# EasyEDA Pro project 主板.eprj, schematic Schematic1
Board Name: Board1; Create Date: 2024-09-01; Page Name: P1; Project Name: 主板; Schematic Name: Schematic1; Update Date: 2024-10-02; Company: 嘉立创EDA; Drawed: wiselook; Page Size: A4; Version: V1.0
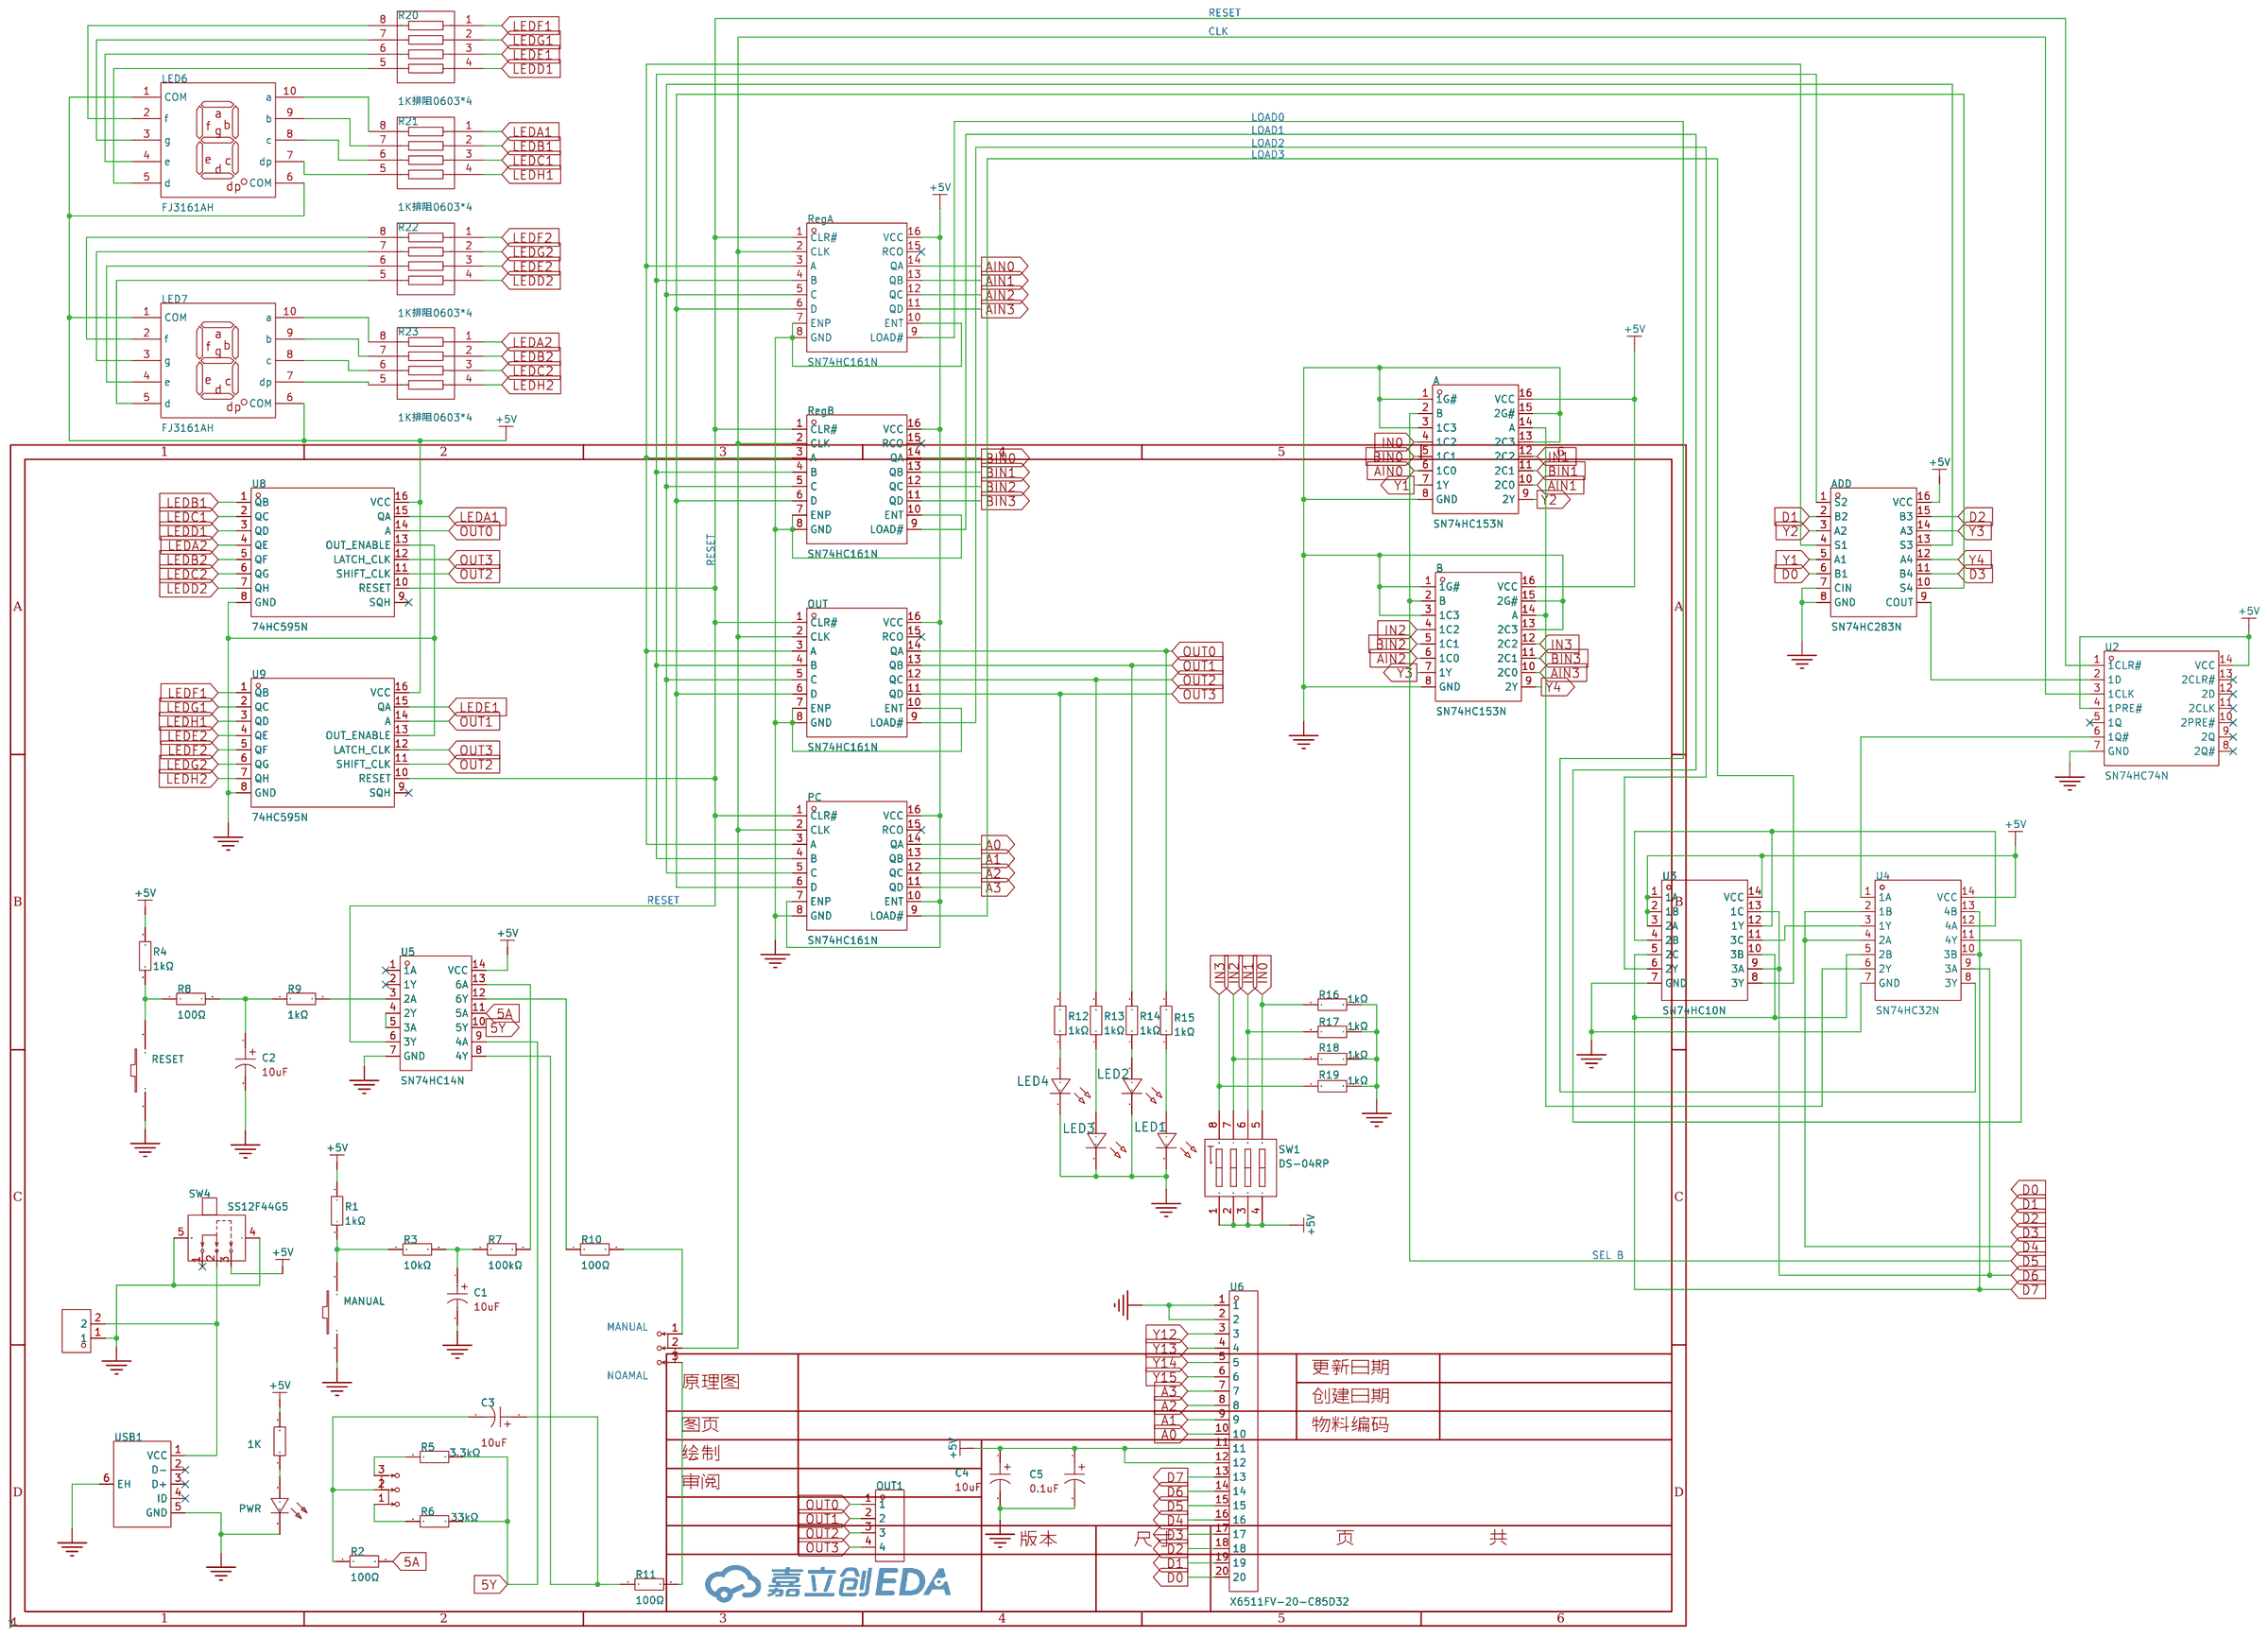
[diagram p0: schematic sheet]

## Parts
A  SN74HC153N  [DIP-16_L20.3-W10.1-P2.54-LS7.62-BL]
ADD  SN74HC283N  [DIP-16_L20.3-W10.2-P2.54-LS7.6-BL]
B  SN74HC153N  [DIP-16_L20.3-W10.1-P2.54-LS7.62-BL]
C1  电解电容  [CAP-TH_BD5.0-P2.50-D0.5-FD]
C2  电解电容  [CAP-TH_BD5.0-P2.50-D0.5-FD]
C3  电解电容  [CAP-TH_BD5.0-P2.50-D0.5-FD]
C4  电解电容  [C0805]
C5  电解电容  [C0805]
LED1  -  [LED_0805]
LED2  -  [LED_0805]
LED3  -  [LED_0805]
LED4  -  [LED_0805]
LED6  FJ3161AH  [LED-SEG-TH_10P-L14.0-W7.5-P2.54-S5.08-TL]
LED7  FJ3161AH  [LED-SEG-TH_10P-L14.0-W7.5-P2.54-S5.08-TL]
MANUAL  YTS1S0161BBT00  [KEY-TH_2P-L6.0-W6.0-P5.00]
OUT  SN74HC161N  [DIP-16_L20.3-W10.1-P2.54-LS7.62-BL]
OUT1  HDR2.54-LI-2x4P  [HDR-TH_4P-P2.54-V-M]
PC  SN74HC161N  [DIP-16_L20.3-W10.2-P2.54-LS7.6-BL]
PWR  PWR  [LED0805-R-RD_GREEN]
R1  1kΩ  [Res_1/4W]
R2  100Ω  [Res_1/4W]
R3  10kΩ  [Res_1/4W]
R4  1kΩ  [Res_1/4W]
R5  3.3kΩ  [Res_1/4W]
R6  33kΩ  [Res_1/4W]
R7  100kΩ  [Res_1/4W]
R8  100Ω  [Res_1/4W]
R9  1kΩ  [Res_1/4W]
R10  100Ω  [Res_1/4W]
R11  100Ω  [Res_1/4W]
R12  1kΩ  [Res_1/4W]
R13  1kΩ  [Res_1/4W]
R14  1kΩ  [Res_1/4W]
R15  1kΩ  [Res_1/4W]
R16  1kΩ  [Res_1/4W]
R17  1kΩ  [Res_1/4W]
R18  1kΩ  [Res_1/4W]
R19  1kΩ  [Res_1/4W]
R20  1K排阻0603*4  [RES-ARRAY-SMD_0603-8P-L3.2-W1.6-TL]
R21  1K排阻0603*4  [RES-ARRAY-SMD_0603-8P-L3.2-W1.6-TL]
R22  1K排阻0603*4  [RES-ARRAY-SMD_0603-8P-L3.2-W1.6-TL]
R23  1K排阻0603*4  [RES-ARRAY-SMD_0603-8P-L3.2-W1.6-TL]
R24  1K  [R0805]
RegA  SN74HC161N  [DIP-16_L20.3-W10.2-P2.54-LS7.6-BL]
RegB  SN74HC161N  [DIP-16_L20.3-W10.2-P2.54-LS7.6-BL]
RESET  YTS1S0161BBT00  [KEY-TH_2P-L6.0-W6.0-P5.00]
SW1  DS-04RP  [SW-TH_DS-04XP]
SW2  SS12D00G3  [SW-TH_SS-12D01-GX]
SW3  SS12D00G3  [SW-TH_SS-12D01-GX]
SW4  SS12F44G5  [SW-TH_SHOU-HAN_SS12F44G4]
U2  SN74HC74N  [DIP-14_L17.8-W10.1-P2.54-LS7.62-BL]
U3  SN74HC10N  [DIP-14_L17.8-W10.1-P2.54-LS7.62-BL]
U4  SN74HC32N  [DIP-14_L17.8-W10.1-P2.54-LS7.62-BL]
U5  SN74HC14N  [DIP-14_L17.8-W10.1-P2.54-LS7.62-BL]
U6  X6511FV-20-C85D32  [HDR-TH_20P-P2.54-V-F]
U7  Jumper2  [HDR-TH_2P-P2.54-V-M-1]
U8  74HC595N  [DIP-16_L20.3-W10.1-P2.54-LS7.62-BL]
U9  74HC595N  [DIP-16_L20.3-W10.1-P2.54-LS7.62-BL]
USB1  -  [USB_Micro]

## Library data of the parts
A B = SN74HC153N: Supplier Part: C157529; Manufacturer: TI(德州仪器); Supplier Footprint: PDIP-16; Datasheet: https://www.ti.com/cn/lit/gpn/sn74hc153; Supplier: LCSC; Type: 多路复用器; Voltage Supply Source: 单电源; Supply Voltage: 2V~6V; Sink Current: 7.8mA; Source Current: 7.8mA; Operating temperature: -40℃~+85℃
ADD = SN74HC283N(LX): LCSC Part Name: 集成电路; Supplier Part: C24833608; Manufacturer: LX(灵星芯微); Supplier Footprint: DIP-16; Datasheet: https://atta.szlcsc.com/upload/public/pdf/source/20240703/B2F67AF99878386B1DFCEFAB01FADF26.pdf; Supplier: LCSC; Supply Voltage: 2V~6V; Operating Temperature: -40℃~+125℃
C1-C4 = 电解电容: Supplier Part: C9900022333; Supplier Footprint: CAP-TH; JLCPCB Part Class: 扩展库; Supplier: LCSC; Capacitance: 10uF
C5 = 电解电容: Supplier Part: C9900022333; Supplier Footprint: CAP-TH; JLCPCB Part Class: 扩展库; Supplier: LCSC; Capacitance: 0.1uF
LED1-LED4 = LED_0805-R: Supplier Footprint: 0805
LED6 LED7 = FJ3161AH: LCSC Part Name: 0.36英寸红色数码管 共阴极; Supplier Part: C10684; Manufacturer: 志浩; Supplier Footprint: 插件; JLCPCB Part Class: 扩展库; Datasheet: https://atta.szlcsc.com/upload/public/pdf/source/20121231/1457706574245.pdf; Supplier: LCSC; Luminous Color: 红色; LED Polarity: 共阴极; Digit/Alpha Size(inch): 0.36
MANUAL RESET = YTS1S0161BBT00: LCSC Part Name: YIYUAN(怡远) 6x6x4.5mm  180gf 3.5长中两脚; Supplier Part: C22368614; Manufacturer: YIYUAN(怡远); Supplier Footprint: 插件,6x6mm; Datasheet: https://atta.szlcsc.com/upload/public/pdf/source/20240327/338B5882365579BF203D54FA0801B220.pdf; Supplier: LCSC; Operating Force: 2.6N; Switch Length: 6mm; Switch Width: 6mm; Switch Height: 4.5mm
OUT PC RegA RegB = SN74HC161N: Supplier Part: C273647; Manufacturer: TI(德州仪器); Supplier Footprint: PDIP-16; JLCPCB Part Class: 扩展库; Datasheet: https://www.ti.com/cn/lit/gpn/sn74hc161; Supplier: LCSC; Logic Type: 二进制计数器; Direction: 向上计数器; Supply Voltage: 2V~6V; Number of Elements: 1; Number of Bits per Element: 4; Trigger Type: 正边沿; Reset Style: 异步; Timing mode: 同步; Count Rate: 36MHz; Operating Temperature: -40℃~+85℃
OUT1 = HDR2.54-LI-2x4P: Supplier Part: C9900020145; JLCPCB Part Class: 扩展库; Supplier: LCSC
PWR = LED_0805: Supplier Part: C9900014946; Supplier Footprint: LED0; JLCPCB Part Class: Extended Part; Supplier: LCSC
R1-R19 = Res_AXIAL-1/4W: Supplier Footprint: 轴向引线
R20-R23 = 91K排阻0603*4: Supplier Part: C9900007684; Supplier Footprint: 0603*4; JLCPCB Part Class: Extended Part; Supplier: LCSC
R24 = Res_0805: Supplier Footprint: 0805
SW1 = DS-04RP_C319060: LCSC Part Name: 间距2.54mm 平拨,凸起式 4位拨码开关; Supplier Part: C319060; Manufacturer: XKB Connectivity(中国星坤); Supplier Footprint: 插件; Datasheet: https://atta.szlcsc.com/upload/public/pdf/source/20211009/0D012837DC731519353CF5F5335F3C3F.pdf; Supplier: LCSC; Type: 平拨,凸起式; Circuit: 单刀单掷; Number of Positions: 4位; Pin Style: PC引脚; Lead Pitch: 2.54mm; Current Rating: 25mA; Voltage Rating: 24V; Operating Temperature: -20℃~+70℃; Operating Life: 3千次; Color: 红色
SW2 SW3 = SS12D00G3: Supplier Part: C9900018735; Supplier Footprint: SW-TH; JLCPCB Part Class: 扩展库; Supplier: LCSC
SW4 = SS12F44G5: Supplier Part: C22435641; Manufacturer: HanElectricity(瀚源); Supplier Footprint: 插件-5P,12.2x5.5mm; JLCPCB Part Class: 扩展库; Datasheet: https://atta.szlcsc.com/upload/public/pdf/source/20240521/251CCE5309E68669C05257185F219EB8.pdf; Supplier: LCSC
U2 = SN74HC74N: Supplier Part: C2895; Manufacturer: TI(德州仪器); Supplier Footprint: DIP-14; JLCPCB Part Class: 扩展库; Datasheet: https://www.ti.com/cn/lit/gpn/sn74hc74; Supplier: LCSC; Type: D-型; Trigger Type: 上升沿; Supply Voltage: 2V~6V; Clock Frequency: 60MHz; Function: 置位和复位; Number of Elements: 2; Number of Bits per Element: 1; Output Type: 互补型; Maximum Propagation Delay: 30ns@6V,50pF; Series: 74HC系列; Sink Current: 5.2mA; Source Current: 5.2mA; Quiescent Current (Iq): 4uA; Input Capacitance: 3pF; Operating Temperature: -40℃~+85℃
U3 = SN74HC10N: Supplier Part: C2888; Manufacturer: TI(德州仪器); Supplier Footprint: DIP-14; JLCPCB Part Class: 扩展库; Datasheet: https://www.ti.com/cn/lit/gpn/sn74hc10; Supplier: LCSC; Logic Gate Type: 与非门; Number of Channels: 3; Supply Voltage: 2V~6V; Quiescent Current (Max): 2uA; Sink Current: 5.2mA; Source Current: 5.2mA; High Level Range (VIH): 1.5V~4.2V; Low Level Range (VIL): 500mV~1.8V; Series: 74HC系列; Propagation Delay Time: 16ns@6V,50pF; Operating Temperature: -40℃~+85℃
U4 = SN74HC32N: Supplier Part: C2894; Manufacturer: TI(德州仪器); Supplier Footprint: DIP-14; JLCPCB Part Class: 扩展库; Datasheet: http://www.ti.com/cn/lit/gpn/sn74hc32; Supplier: LCSC; Logic Gate Type: 或门; Number of Channels: 4; Supply Voltage: 2V~6V; Quiescent Current (Max): 2uA; Sink Current: 5.2mA; Source Current: 5.2mA; High Level Range (VIH): 1.5V~4.2V; Low Level Range (VIL): 500mV~1.8V; Series: 74HC系列; Propagation Delay Time: 17ns@6V,50pF; Operating Temperature: -40℃~+85℃
U5 = SN74HC14N: LCSC Part Name: 六路施密特触发反相器; Supplier Part: C2907; Manufacturer: TI(德州仪器); Supplier Footprint: DIP-14; JLCPCB Part Class: 扩展库; Datasheet: https://www.ti.com/cn/lit/gpn/sn74hc14; Supplier: LCSC; Input Type: 施密特触发器; Supply Voltage(Single): 2V~6V; Supply Current (Max): 2uA; Number of Circuits: 6; Number of Inputs: 1; Sink Current: 5.2mA; Source Current: 5.2mA; High level range (VIH): 1.5V~4.2V; Low level range (VIL): 300mV~1.2V; Max Propagation Delay: 21ns@6V,50pF; Series: 74HC系列; Operating Temperature: -40℃~+85℃
U6 = X6511FV-20-C85D32: LCSC Part Name: 间距:2.54mm 1x20P 直插; Supplier Part: C2883737; Manufacturer: XKB Connectivity(中国星坤); Supplier Footprint: 插件,P=2.54mm; Datasheet: https://atta.szlcsc.com/upload/public/pdf/source/20211009/E31A179D77B4765F9C2936200B697B47.pdf; Supplier: LCSC; Holes Structure: 1x20P; Pitch: 2.54mm; Circular Hole / Square Hole: 方孔; Mounting Type: 直插; Number of Rows: 单排; Number of Holes: 20P; Current Rating (Max): 3A; Voltage Rating (Max): 250V; Holes Direction: 顶部; Insulation Height: 8.5mm; Contact Material: 黄铜; Contact Plating: 金; Operating Temperature Range: -40℃~+105℃; Soldering Temperature(Max): 260℃
U7 = Jumper2: Supplier Part: C2940092; Supplier Footprint: HDR-TH-2P-2.54mm; JLCPCB Part Class: 扩展库; Supplier: LCSC
U8 U9 = 74HC595N: LCSC Part Name: 74HC595N 停产; Supplier Part: C669328; Manufacturer: HTC; Supplier Footprint: DIP-16; JLCPCB Part Class: 扩展库; Datasheet: https://atta.szlcsc.com/upload/public/pdf/source/20200618/C669328_990EF01DE8E9A3CA0AEF9E0C28ED6020.pdf; Supplier: LCSC
USB1 = USB_Micro-B: Supplier Footprint: SMD

## Nets
+5V: A.16(VCC) ADD.16(VCC) B.16(VCC) C4.1 C5.1 LED6.1(COM) LED6.6(COM) LED7.1(COM) LED7.6(COM) OUT.16(VCC) PC.7(ENP) PC.10(ENT) PC.16(VCC) R1.2 R4.2 R24.2 RegA.16(VCC) RegB.16(VCC) SW1.1(A1) SW1.2(A2) SW1.3(A3) SW1.4(A4) SW4.3 U2.4(1PRE#) U2.14(VCC) U3.1(1A) U3.2(1B) U3.3(2A) U3.14(VCC) U4.14(VCC) U5.14(VCC) U6.11 U6.12 U8.16(VCC) U9.16(VCC)
GND: A.1(1G#) A.3(1C3) A.8(GND) A.13(2C3) A.15(2G#) ADD.7(CIN) ADD.8(GND) B.1(1G#) B.3(1C3) B.8(GND) B.13(2C3) B.15(2G#) C1.2 C2.2 C4.2 C5.2 LED1.1(C) LED2.1(C) LED3.1(C) LED4.1(C) MANUAL.1 OUT.7(ENP) OUT.8(GND) OUT.10(ENT) PC.8(GND) PWR.2(C) R16.2 R17.2 R18.2 R19.2 RegA.7(ENP) RegA.8(GND) RegA.10(ENT) RegB.7(ENP) RegB.8(GND) RegB.10(ENT) RESET.1 SW4.4 SW4.5 U2.7(GND) U3.7(GND) U4.7(GND) U5.7(GND) U6.1 U6.2 U7.1 U8.8(GND) U8.13(OUT_ENABLE) U9.8(GND) U9.13(OUT_ENABLE) USB1.5(GND) USB1.6(EH)
5A: R2.2 U5.11(5A)
5Y: R5.2 R6.2 U5.9(4A) U5.10(5Y)
A0: PC.14(QA) U6.10
A1: PC.13(QB) U6.9
A2: PC.12(QC) U6.8
A3: PC.11(QD) U6.7
AIN0: A.6(1C0) RegA.14(QA)
AIN1: A.10(2C0) RegA.13(QB)
AIN2: B.6(1C0) RegA.12(QC)
AIN3: B.10(2C0) RegA.11(QD)
BIN0: A.5(1C1) RegB.14(QA)
BIN1: A.11(2C1) RegB.13(QB)
BIN2: B.5(1C1) RegB.12(QC)
BIN3: B.11(2C1) RegB.11(QD)
D0: ADD.6(B1) U6.20
D1: ADD.2(B2) U6.19
D2: ADD.15(B3) U6.18
D3: ADD.11(B4) U6.17
D4: U4.2(1B) U4.4(2A) U6.16
D5: A.2(B) B.2(B) U6.15
D6: U3.9(3A) U3.13(1C) U4.9(3A) U6.14
D7: U3.5(2C) U3.10(3B) U4.5(2B) U4.10(3B) U4.13(4B) U6.13
IN0: A.4(1C2) R16.1 SW1.5
IN1: A.12(2C2) R17.1 SW1.6
IN2: B.4(1C2) R18.1 SW1.7
IN3: B.12(2C2) R19.1 SW1.8
LEDA1: R21.1 U8.15(QA)
LEDA2: R23.1 U8.4(QE)
LEDB1: R21.2 U8.1(QB)
LEDB2: R23.2 U8.5(QF)
LEDC1: R21.3 U8.2(QC)
LEDC2: R23.3 U8.6(QG)
LEDD1: R20.4 U8.3(QD)
LEDD2: R22.4 U8.7(QH)
LEDE1: R20.3 U9.15(QA)
LEDE2: R22.3 U9.4(QE)
LEDF1: R20.1 U9.1(QB)
LEDF2: R22.1 U9.5(QF)
LEDG1: R20.2 U9.2(QC)
LEDG2: R22.2 U9.6(QG)
LEDH1: R21.4 U9.3(QD)
LEDH2: R23.4 U9.7(QH)
OUT0: OUT.14(QA) OUT1.1 R15.2 U8.14(A)
OUT1: OUT.13(QB) OUT1.2 R14.2 U9.14(A)
OUT2: OUT.12(QC) OUT1.3 R13.2 U8.11(SHIFT_CLK) U9.11(SHIFT_CLK)
OUT3: OUT.11(QD) OUT1.4 R12.2 U8.12(LATCH_CLK) U9.12(LATCH_CLK)
Y1: A.7(1Y) ADD.5(A1)
Y2: A.9(2Y) ADD.3(A2)
Y3: ADD.14(A3) B.7(1Y)
Y4: ADD.12(A4) B.9(2Y)
Y12: U6.3
Y13: U6.4
Y14: U6.5
Y15: U6.6
$1N4248: LED4.2(A) R12.1
$1N4255: LED1.2(A) R15.1
$1N4259: LED2.2(A) R14.1
$1N4264: LED3.2(A) R13.1
$1N6580: ADD.4(S1) OUT.3(A) PC.3(A) RegA.3(A) RegB.3(A)
$1N6590: ADD.1(S2) OUT.4(B) PC.4(B) RegA.4(B) RegB.4(B)
$1N6595: ADD.13(S3) OUT.5(C) PC.5(C) RegA.5(C) RegB.5(C)
$1N6604: ADD.10(S4) OUT.6(D) PC.6(D) RegA.6(D) RegB.6(D)
$1N9749: C1.1 R3.2 R7.1
$1N9779: MANUAL.2 R1.1 R3.1
$1N9868: R4.1 R8.1 RESET.2
$1N9876: C2.1 R8.2 R9.1
$1N11263: ADD.9(COUT) U2.2(1D)
$1N33937: LED6.2(f) R20.8
$1N33943: LED6.3(g) R20.7
$1N33953: LED6.4(e) R20.6
$1N33959: LED6.5(d) R20.5
$1N35657: LED7.2(f) R22.8
$1N35663: LED7.3(g) R22.7
$1N35669: LED7.4(e) R22.6
$1N35676: LED7.5(d) R22.5
Net-(A-14): A.14(A) B.14(A) U4.6(2Y)
Net-(C3-1): C3.1 R11.1 U5.8(4Y)
Net-(C3-2): C3.2 R2.1 SW3.2
Net-(LED6-7): LED6.7(dp) R21.5
Net-(LED6-8): LED6.8(c) R21.6
Net-(LED6-9): LED6.9(b) R21.7
Net-(LED6-10): LED6.10(a) R21.8
Net-(LED7-7): LED7.7(dp) R23.5
Net-(LED7-8): LED7.8(c) R23.6
Net-(LED7-9): LED7.9(b) R23.7
Net-(LED7-10): LED7.10(a) R23.8
Net-(OUT-1): OUT.1(CLR#) PC.1(CLR#) RegA.1(CLR#) RegB.1(CLR#) U2.1(1CLR#) U5.6(3Y) U8.10(RESET) U9.10(RESET)
Net-(OUT-2): OUT.2(CLK) PC.2(CLK) RegA.2(CLK) RegB.2(CLK) SW2.2 U2.3(1CLK)
Net-(OUT-9): OUT.9(LOAD#) U3.6(2Y)
Net-(PC-9): PC.9(LOAD#) U3.8(3Y)
Net-(PWR-1): PWR.1(A) R24.1
Net-(R5-1): R5.1 SW3.3
Net-(R6-1): R6.1 SW3.1
Net-(R7-2): R7.2 U5.13(6A)
Net-(R9-2): R9.2 U5.3(2A)
Net-(R10-1): R10.1 U5.12(6Y)
Net-(R10-2): R10.2 SW2.1
Net-(R11-2): R11.2 SW2.3
Net-(RegA-9): RegA.9(LOAD#) U4.8(3Y)
Net-(RegB-9): RegB.9(LOAD#) U4.11(4Y)
Net-(SW4-2): SW4.2 U7.2 USB1.1(VCC)
Net-(U2-6): U2.6(1Q#) U4.1(1A)
Net-(U3-4): U3.4(2B) U3.12(1Y) U4.12(4A)
Net-(U3-11): U3.11(3C) U4.3(1Y)
Net-(U5-4): U5.4(2Y) U5.5(3A)

Not connected (* = marked no-connect by the designer): OUT 15(RCO)*; PC 15(RCO)*; RegA 15(RCO)*; RegB 15(RCO)*; SW4 1*; U2 5(1Q)* 8(2Q#)* 9(2Q)* 10(2PRE#)* 11(2CLK)* 12(2D)* 13(2CLR#)*; U5 1(1A)* 2(1Y)*; U8 9(SQH)*; U9 9(SQH)*; USB1 2(D-)* 3(D+)* 4(ID)*

## Notes on the sheet
- RESET
- CLK
- LOAD0
- LOAD1
- LOAD2
- LOAD3
- RESET
- RESET
- SEL B
- MANUAL
- NOAMAL
